# EAGLE design uBridge44_r1 (EAGLE 6.2)
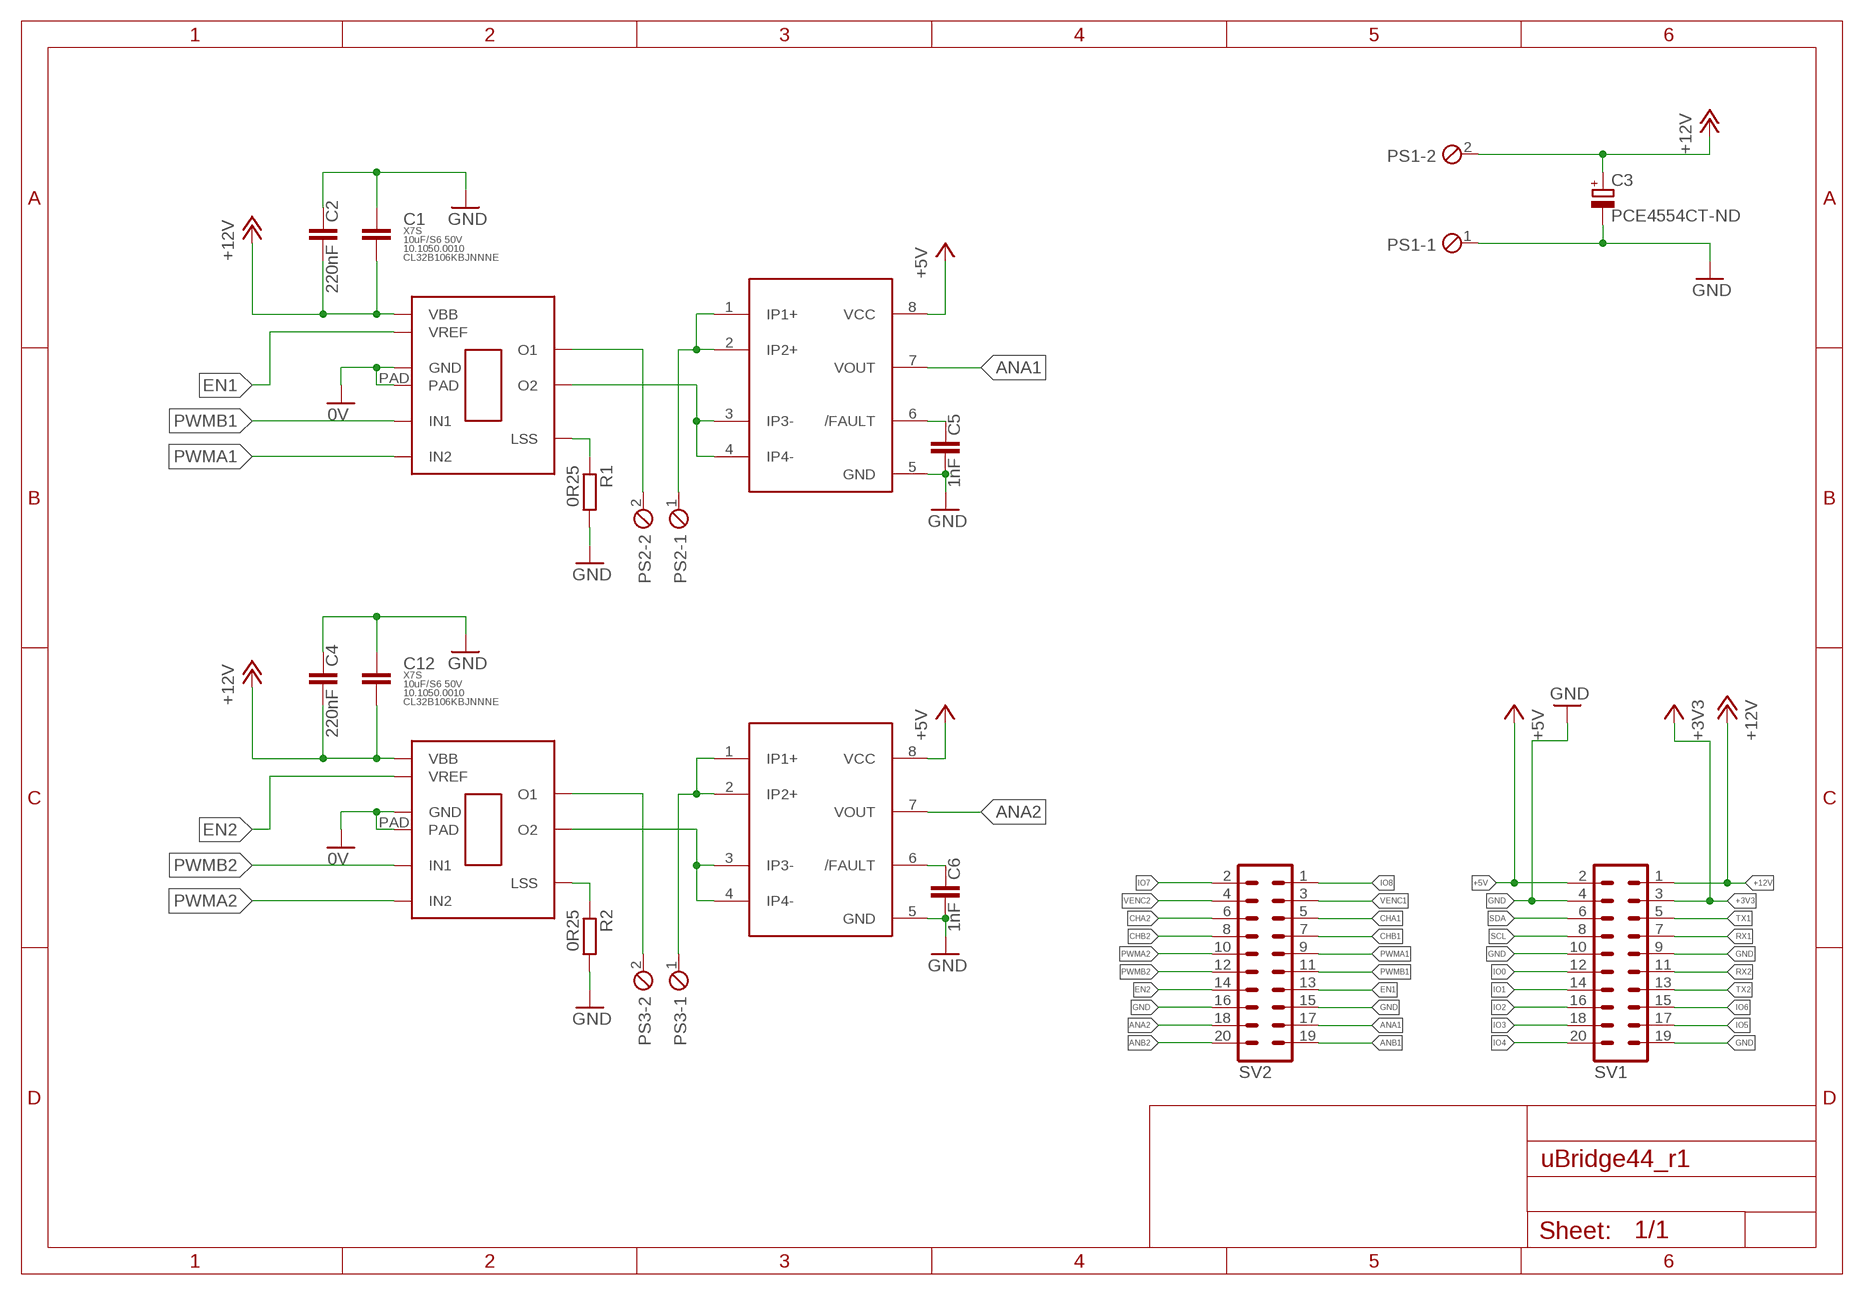
[diagram p0: schematic, sheet 1]

## Parts
C1  10uF/S6 50V  C-EUC3225  [C3225]
C2  220nF  C-EUC0805K  [C0805K]
C3  PCE4554CT-ND  CPOL-EUUD-6,3X7,7  [UD-6,3X7,7_NICHICON]
C4  220nF  C-EUC0805K  [C0805K]
C5  1nF  C-EUC0805K  [C0805K]
C6  1nF  C-EUC0805K  [C0805K]
C12  10uF/S6 50V  C-EUC3225  [C3225]
PS1  MPT2  [2POL254]
PS2  MPT2  [2POL254]
PS3  MPT2  [2POL254]
R1  0R25  R-EU_R1206  [R1206]
R2  0R25  R-EU_R1206  [R1206]
SV1  MA10-2  [MA10-2]
SV2  MA10-2  [MA10-2]
U$1  A4950  [SOICN]
U$2  A4950  [SOICN]
U$3  ACS723  ACS711  [SO08]
U$4  ACS723  ACS711  [SO08]

## Nets
+3V3: SV1.3
+5V: SV1.2 U$3.8(VCC) U$4.8(VCC)
+12V: C1.2 C2.2 C3.+ C4.2 C12.2 PS1.2 SV1.1 U$1.5VCC(VBB) U$2.5VCC(VBB)
ANA1: SV2.17 U$3.7(VOUT)
ANA2: SV2.18 U$4.7(VOUT)
ANB1: SV2.19
ANB2: SV2.20
CHA1: SV2.5
CHA2: SV2.6
CHB1: SV2.7
CHB2: SV2.8
EN1: SV2.13 U$1.4CS(VREF)
EN2: SV2.14 U$2.4CS(VREF)
GND: C1.1 C2.1 C3.- C4.1 C5.2 C6.2 C12.1 PS1.1 R1.2 R2.2 SV1.4 SV1.9 SV1.10 SV1.19 SV2.15 SV2.16 U$1.1VIN(GND) U$1.PAD U$2.1VIN(GND) U$2.PAD U$3.5(GND) U$4.5(GND) ; supply symbol labelled 0V
IO0: SV1.12
IO1: SV1.14
IO2: SV1.16
IO3: SV1.18
IO4: SV1.20
IO5: SV1.17
IO6: SV1.15
IO7: SV2.2
IO8: SV2.1
N$1: R2.1 U$2.7BOOT(LSS)
N$2: PS3.2 U$2.6GND(O1)
N$3: U$2.8SW(O2) U$4.3(IP3-) U$4.4(IP4-)
N$4: C5.1 U$3.6(/FAULT)
N$5: C6.1 U$4.6(/FAULT)
N$6: PS2.1 U$3.1(IP1+) U$3.2(IP2+)
N$8: PS2.2 U$1.6GND(O1)
N$9: PS3.1 U$4.1(IP1+) U$4.2(IP2+)
N$10: R1.1 U$1.7BOOT(LSS)
N$12: U$1.8SW(O2) U$3.3(IP3-) U$3.4(IP4-)
PWMA1: SV2.9 U$1.2TON(IN2)
PWMA2: SV2.10 U$2.2TON(IN2)
PWMB1: SV2.11 U$1.3EN(IN1)
PWMB2: SV2.12 U$2.3EN(IN1)
RX1: SV1.7
RX2: SV1.11
SCL: SV1.8
SDA: SV1.6
TX1: SV1.5
TX2: SV1.13
VENC1: SV2.3
VENC2: SV2.4

## Library data of the parts
C1 C12 = rcl:C-EU: CAPACITOR, European symbol; CASE: C3225 [EIA CC1210]; CODE: CL32B106KBJNNNE; KATODO: 10.1050.0010; TEMPERATURE: X7S
C2 C4-C6 = rcl:C-EU: CAPACITOR, European symbol
C3 = rcl:CPOL-EU: POLARIZED CAPACITOR, European symbol
PS1-PS3 = Personale:MPT2: PHOENIX CONNECTOR
R1 R2 = rcl:R-EU_: RESISTOR, European symbol
SV1 SV2 = con-lstb:MA10-2: PIN HEADER; OC_FARNELL: unknown; OC_NEWARK: unknown
U$1 U$2 = allegro:A4950
U$3 U$4 = allegro:ACS711

## Net classes
0 default: width 0.203 mm, clearance 0.203 mm
1 power: width 0.305 mm, clearance 0.203 mm

## Board
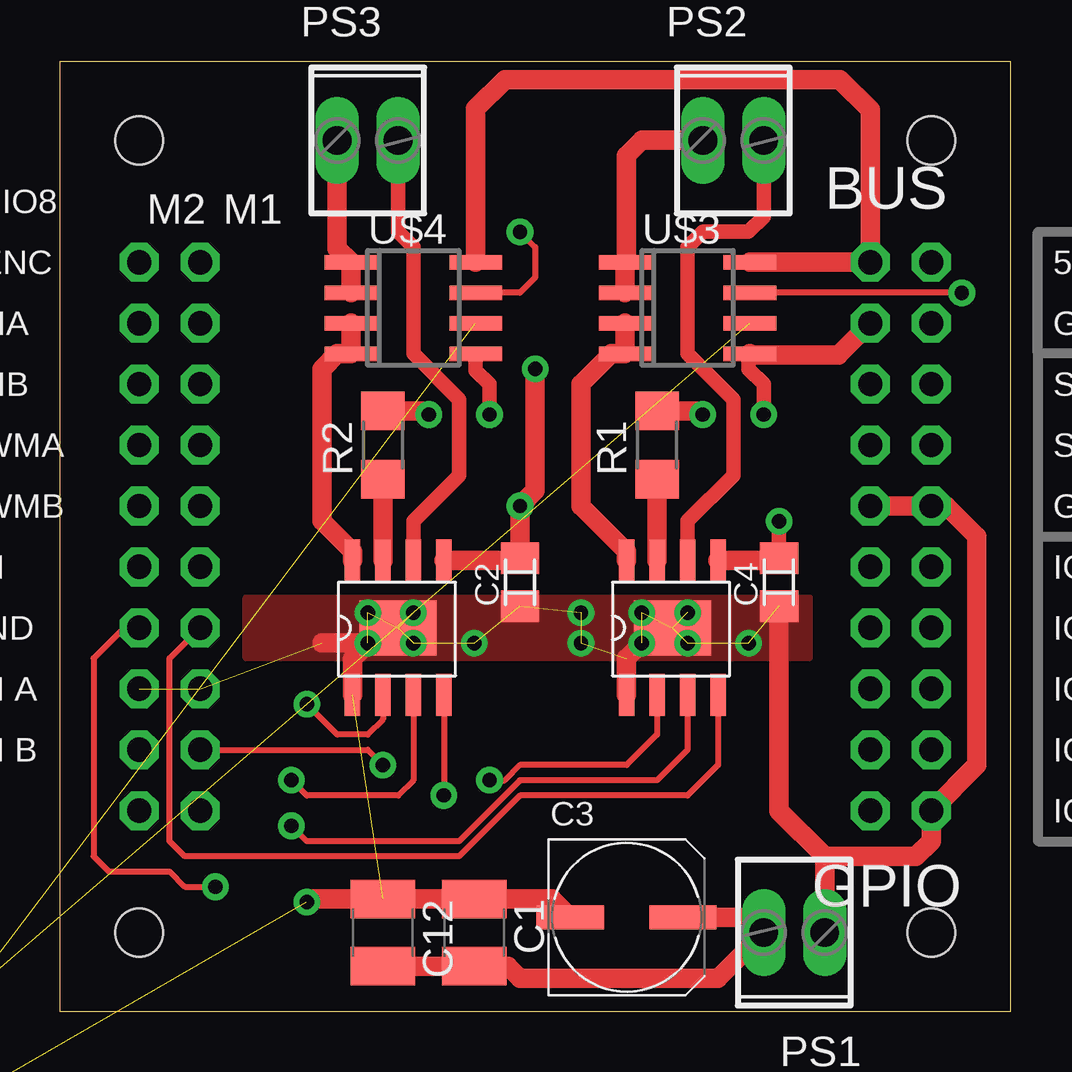
[diagram p1: board, top side]
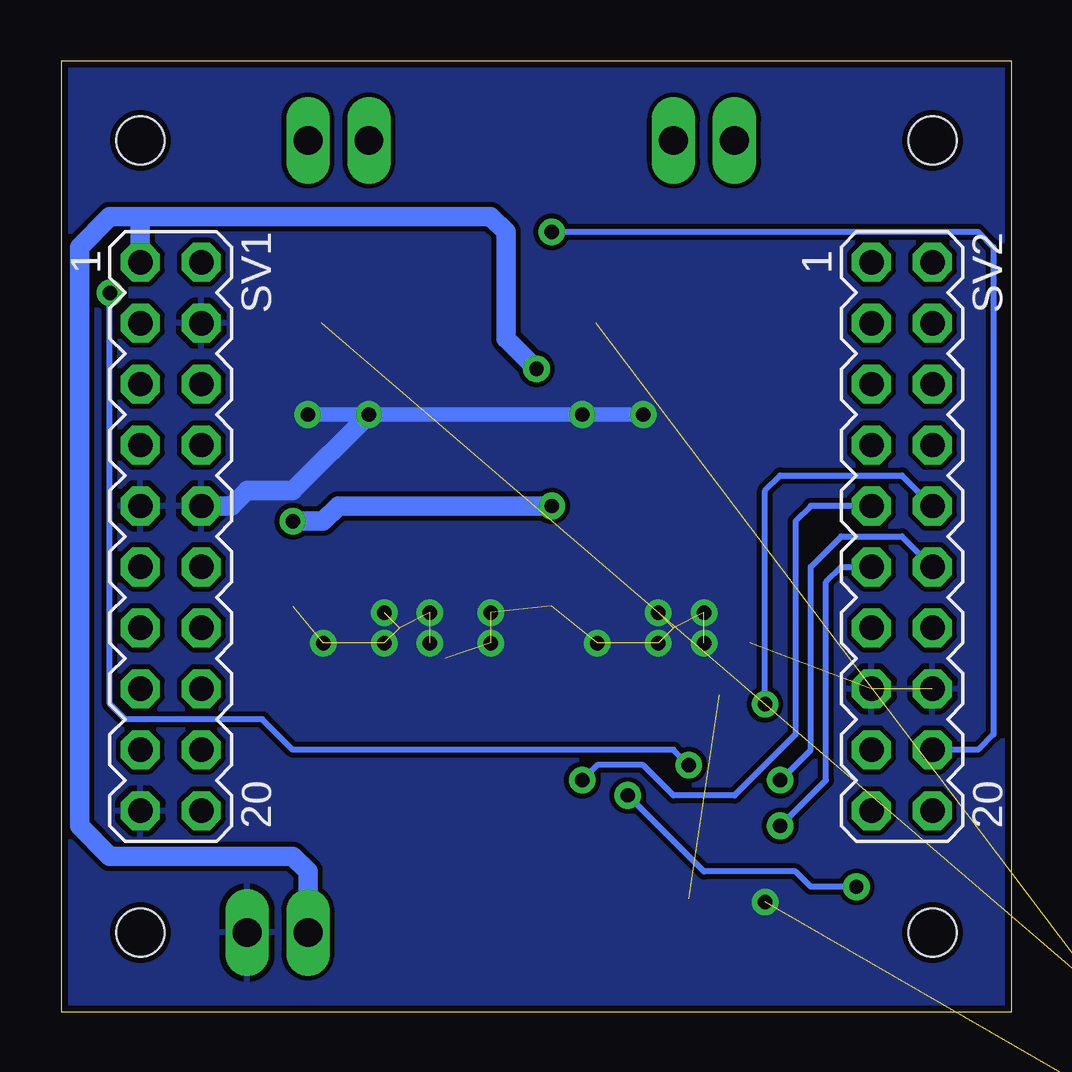
[diagram p2: board, bottom side, seen from below]

Size 39.62 x 39.62 mm. Coordinates in mm from the lower left corner, seen from the top.
Outline: 39.62,39.62 39.62,0 0,0 0,39.62 39.62,39.62
Copper layers (1*16): Top 0.035mm / dielectric 1.5mm / Bottom 0.035mm
Design rules: minimum track width 8mil, minimum drill 20mil, track to track 8mil, track to pad 8mil, pad to pad 8mil, via to via 8mil, smd to smd 8mil, copper to edge 10mil, drill to drill 8mil, minimum pad ring 12mil, minimum via ring 10mil, stop-mask expansion 4mil, vias tented up to drill 25mil, thermal gap 10mil
Holes 2 mm at 3.3,36.32 36.32,3.3 36.32,36.32 3.3,3.3
tRestrict: area -0.8,-2.4 to 42.4,0.1; area -0.8,41.4 to 42.4,43.9; area -2.4,-0.5 to 0.1,42.7; area 41.1,-0.5 to 43.6,42.7
bRestrict: area -2.4,-0.5 to 0.1,42.7; area 41.1,-0.5 to 43.6,42.7; area -0.8,-2.4 to 42.4,0.1; area -0.8,41.4 to 42.4,43.9

### Footprints (pad centres in the part's own frame; a part is rotated, then mirrored left to right if it is on the bottom)
C3225 = smd 1.6 x 2.7: 1 -1.4,0; 2 1.4,0
C0805K = smd 1.3 x 1.6: 1 -1,0; 2 1,0
UD-6,3X7,7_NICHICON = smd 2.8 x 1: + 2.35,0; - -2.35,0
2POL254 = drill 1.2 long: 1 -1.27,0; 2 1.27,0
R1206 = smd 1.6 x 1.803: 1 -1.422,0; 2 1.422,0
MA10-2 = drill 1.016 octagon: 1 -11.43,-1.27; 2 -11.43,1.27; 3 -8.89,-1.27; 4 -8.89,1.27; 5 -6.35,-1.27; 6 -6.35,1.27; 7 -3.81,-1.27; 8 -3.81,1.27; 9 -1.27,-1.27; 10 -1.27,1.27; 11 1.27,-1.27; 12 1.27,1.27; 13 3.81,-1.27; 14 3.81,1.27; 15 6.35,-1.27; 16 6.35,1.27; 17 8.89,-1.27; 18 8.89,1.27; 19 11.43,-1.27; 20 11.43,1.27
SOICN = smd 0.65 x 1.75: 1VIN -1.905,-2.8; 2TON -0.635,-2.8; 3EN 0.635,-2.8; 4CS 1.905,-2.8; 5VCC 1.905,2.8; 6GND 0.635,2.8; 7BOOT -0.635,2.8; 8SW -1.905,2.8 | smd 3.2 x 2.3: PAD 0,0
SO08 = smd 0.6 x 2.2: 1 -1.905,-2.6; 2 -0.635,-2.6; 3 0.635,-2.6; 4 1.905,-2.6; 5 1.905,2.6; 6 0.635,2.6; 7 -0.635,2.6; 8 -1.905,2.6

### Placement (x,y rotation side)
C1  17.27,3.3 270 top
C2  19.18,17.91 90 top
C3  23.62,3.94 0 top
C4  29.97,17.91 90 top
C5  -13.84,-8.76 0 top  (outside the outline)
C6  -13.84,-13.84 0 top  (outside the outline)
C12  13.46,3.3 270 top
PS1  30.61,3.3 180 top
PS2  28.07,36.32 0 top
PS3  12.83,36.32 0 top
R1  24.89,23.62 90 top
R2  13.46,23.62 90 top
SV1  35.05,19.81 270 bottom
SV2  4.57,19.81 270 bottom
U$1  25.53,16 0 top
U$2  14.1,16 0 top
U$3  26.16,29.34 270 top
U$4  14.73,29.34 270 top

### Tracks (layer width: path | path; a pad name or v marks a point on that pad's centre or on a via)
+5V
  Top 0.813: U$4.8 17.33,37.65 18.54,38.86 32.51,38.86 33.78,37.59 SV1.2 U$3.8
+12V  (via drill 0.6)
  Top 0.61: C4.2 v29.97,20.45
  Top 0.813: U$2.5VCC 19.07,18.8 C2.2 v19.18,21.08 19.81,21.72 v19.81,26.8 | U$1.5VCC 29.87,18.8 C4.2 | C3.+ 28.7,3.94 PS1.2 27.43,1.4 19.18,1.4 18.67,1.9 C1.2 C12.2
  Bottom 0.813: v19.18,21.08 28.07,21.08 28.7,20.45 v29.97,20.45 | SV1.1 36.32,33.15 | 36.32,33.15 37.59,33.15 38.86,31.88 38.86,7.75 37.59,6.48 29.97,6.48 29.34,5.84 PS1.2 | 36.32,33.15 21.72,33.15 21.08,32.51 21.08,28.07 v19.81,26.8
ANA1  (via drill 0.6)
  Top 0.254: v37.59,29.97 U$3.7 | SV2.17 12.83,10.92 v13.46,10.29
  Bottom 0.254: v37.59,29.97 37.59,12.83 36.96,12.19 31.24,12.19 29.97,10.92 14.1,10.92 v13.46,10.29
ANA2  (via drill 0.6)
  Top 0.254: v19.18,32.51 19.81,31.88 19.81,30.61 19.18,29.97 U$4.7
  Bottom 0.254: v19.18,32.51 1.4,32.51 0.76,31.88 0.76,11.56 1.4,10.92 SV2.18
EN1
  Top 0.254: U$1.4CS 27.43,10.29 26.16,9.02 19.18,9.02 16.64,6.48 5.21,6.48 4.57,7.11 4.57,14.73 SV2.13
EN2  (via drill 0.6)
  Top 0.254: U$2.4CS v16,9.02 | SV2.14 2.67,16 1.4,14.73 1.4,6.48 2.03,5.84 4.57,5.84 5.21,5.21 v6.48,5.21
  Bottom 0.254: v16,9.02 12.83,5.84 9.02,5.84 8.38,5.21 v6.48,5.21
GND  (via drill 0.6)  (20 unrouted)
  Top 0.61: U$4.5 17.33,26.74 17.91,26.16 v17.91,24.89 | v29.34,24.89 29.34,26.16 28.7,26.8 28.7,27.37
  Top 0.813: R1.2 26.64,25.04 v26.8,24.89 | U$3.5 28.7,27.37 32.45,27.37 SV1.4 | 31.88,6.48 PS1.1 | C4.1 29.97,8.38 31.88,6.48 | SV1.10 SV1.9 36.96,21.08 38.23,19.81 38.23,10.29 SV1.19 36.32,7.11 35.69,6.48 31.88,6.48 | U$2.1VIN 12.19,14.73 v12.83,15.37 10.92,15.37 | U$1.1VIN 23.62,14.73 v24.26,15.37 | R2.2 15.21,25.04 v15.37,24.89 | C3.- 20.51,4.7 C1.1 C12.1 10.42,4.7 v10.29,4.57
  Bottom 0.61: v15.37,24.89 v17.91,24.89 v26.8,24.89 v29.34,24.89
  Bottom 0.813: SV1.10 32.51,21.08 31.88,21.72 29.97,21.72 v26.8,24.89
  other vias: 12.83,16.64 14.73,16.64 14.73,15.37 17.27,15.37 21.72,16.64 21.72,15.37 24.26,16.64 26.16,16.64 26.16,15.37 28.7,15.37
  pour Top (no thermals): 7.75,17.27 31.24,17.27 31.24,14.73 7.75,14.73
  pour Bottom: -1.14,-1.14 -0.51,40.13 40.13,40.13 40.13,-0.51
N$1
  Top 0.813: U$2.7BOOT R2.1
N$2
  Top 0.61: U$2.6GND 14.73,20.45 16.64,22.35 16.64,25.53 14.73,27.43 14.73,31.88 14.1,32.51 PS3.2
N$3
  Top 0.813: U$2.8SW 12.19,19.18 10.92,20.45 10.92,26.8 11.56,27.43 U$4.4 U$4.3
N$4  (1 unrouted)
N$5  (1 unrouted)
N$6
  Top 0.813: PS2.1 24.26,36.32 23.62,35.69 23.62,31.3 U$3.1 U$3.2
N$8
  Top 0.61: U$1.6GND 26.16,20.45 28.07,22.35 28.07,25.53 26.16,27.43 26.16,31.88 26.8,32.51 28.7,32.51 29.34,33.15 PS2.2
N$9
  Top 0.813: PS3.1 11.56,31.82 U$4.1 U$4.2
N$10
  Top 0.813: U$1.7BOOT R1.1
N$12
  Top 0.813: U$1.8SW 23.62,19.18 21.72,21.08 21.72,26.16 22.99,27.43 U$3.4 U$3.3
PWMA1  (via drill 0.6)
  Top 0.254: U$1.2TON 24.89,11.56 23.62,10.29 19.18,10.29 18.54,9.65 v17.91,9.65
  Bottom 0.254: SV2.9 8.38,21.08 9.02,20.45 9.02,11.56 11.56,9.02 14.1,9.02 15.37,10.29 17.27,10.29 v17.91,9.65
PWMA2  (via drill 0.6)
  Top 0.254: U$2.2TON 13.46,12.19 12.83,11.56 11.56,11.56 v10.29,12.83
  Bottom 0.254: v10.29,12.83 10.29,21.72 9.65,22.35 4.57,22.35 SV2.10
PWMB1  (via drill 0.6)
  Top 0.254: U$1.3EN 26.16,10.92 24.89,9.65 19.18,9.65 16.64,7.11 10.29,7.11 v9.65,7.75
  Bottom 0.254: v9.65,7.75 7.75,9.65 7.75,17.91 7.11,18.54 SV2.11
PWMB2  (via drill 0.6)
  Top 0.254: U$2.3EN 14.73,9.65 14.1,9.02 10.29,9.02 v9.65,9.65
  Bottom 0.254: v9.65,9.65 8.38,10.92 8.38,18.54 7.11,19.81 4.57,19.81 SV2.12

### Text on the board
tPlace: IO7 | IO8 | BUS | M2 | M1 | VENC | 5V | 12V | CHA | GND | 3v | CHB | SDA | TX1 | PWMA | SCL | RX1 | PWMB | GND | GND | EN | IO0 | RX2 | GND | IO1 | TX2 | AN A | IO2 | IO6 | AN B | IO3 | IO5 | IO4 | GND | GPIO